# Altium schematic sheet MCU.SchDoc
size A4
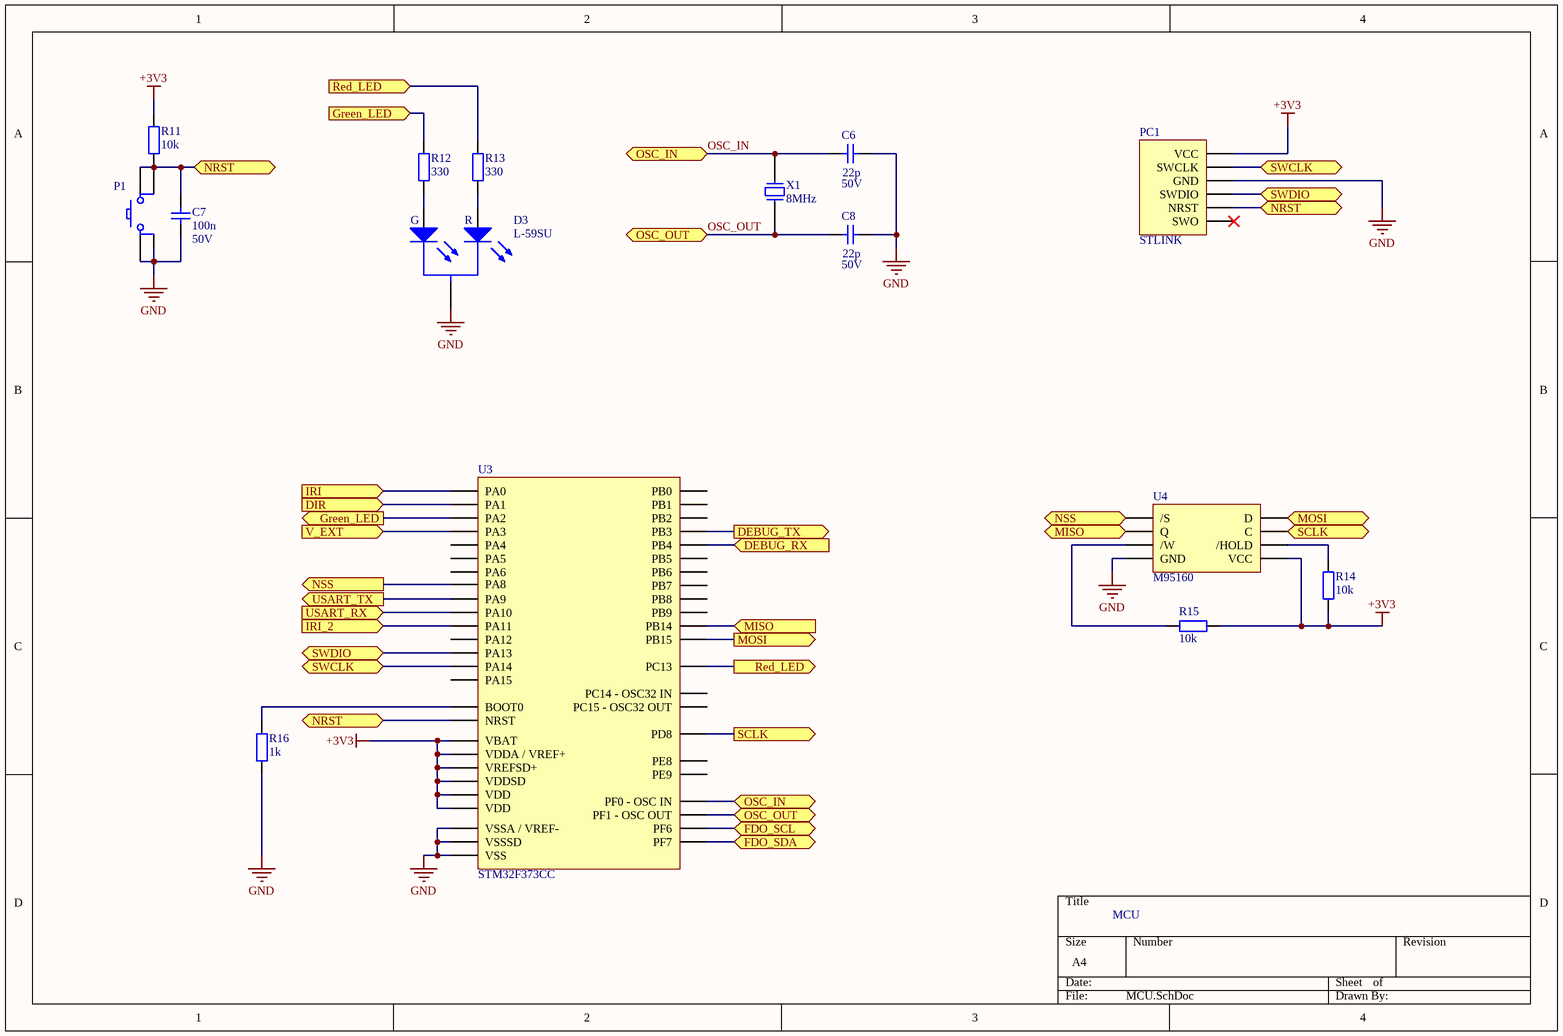
[diagram p0: MCU.SchDoc]

## Parts
C6  value 22p  Voltage Rating: 50V  [C1206]  (hidden comment: CAP)
C7  value 100n  Voltage Rating: 50V  [C1206]  (hidden comment: CAP)
C8  value 22p  Voltage Rating: 50V  [C1206]  (hidden comment: CAP)
D3  L-59SU  [5mmLEDBiCol]
P1  BTN  [PBUTTON]  (value not drawn)
PC1  STLINK  [SWD]
R11  value 10k  [R1206]  (hidden comment: 1206)
R12  value 330  [R1206]  (hidden comment: 1206)
R13  value 330  [R1206]  (hidden comment: 1206)
R14  value 10k  [R1206]  (hidden comment: 1206)
R15  value 10k  [R1206]  (hidden comment: 1206)
R16  value 1k  [R1206]  (hidden comment: 1206)
U3  STM32F373CC  [LQFP48]
U4  M95160  [SOIC8]
X1  value 8MHz  [HC49]  (hidden comment: XTAL)

## Ports
DEBUG_RX (in), DEBUG_TX (out), DIR (in), FDO_SCL (bidir), FDO_SDA (bidir), Green_LED (in), Green_LED (out), IRI (in), IRI_2 (in), MISO (in), MISO (out), MOSI (in), MOSI (out), NRST (bidir), NSS (in), NSS (out), OSC_IN, OSC_OUT, Red_LED (in), Red_LED (out), SCLK (in), SCLK (out), SWCLK (bidir), SWDIO (bidir), USART_RX (in), USART_TX (out), V_EXT (in)

## Nets
+3V3: PC1.1(VCC) R11.1 R14.1 R15.2 U3.1(VBAT) U3.9(VDDA_/_VREF+) U3.17(VDD) U3.24(VDDSD) U3.25(VREFSD+) U3.48(VDD) U4.8(VCC)
GND: C6.1 C7.2 C8.1 D3.2 P1.4 PC1.3(GND) R16.2 U3.8(VSSA_/_VREF-) U3.23(VSSSD) U3.47(VSS) U4.4(GND)
DEBUG_RX: U3.40(PB4) ; port DEBUG_RX
DEBUG_TX: U3.39(PB3) ; port DEBUG_TX
DIR: U3.11(PA1) ; port DIR
FDO_SCL: U3.35(PF6) ; port FDO_SCL
FDO_SDA: U3.36(PF7) ; port FDO_SDA
Green_LED: R12.1 U3.12(PA2) ; port Green_LED
IRI: U3.10(PA0) ; port IRI
IRI_2: U3.32(PA11) ; port IRI_2
MISO: U3.26(PB14) U4.2(Q) ; port MISO
MOSI: U3.27(PB15) U4.5(D) ; port MOSI
NRST: C7.1 P1.1 P1.2 PC1.5(NRST) R11.2 U3.7(NRST) ; port NRST
NSS: U3.29(PA8) U4.1(/S) ; port NSS
OSC_IN: C6.2 U3.5(PF0_-_OSC_IN) X1.1 ; port OSC_IN
OSC_OUT: C8.2 U3.6(PF1_-_OSC_OUT) X1.2 ; port OSC_OUT
Red_LED: R13.1 U3.2(PC13) ; port Red_LED
SCLK: U3.28(PD8) U4.6(C) ; port SCLK
SWCLK: PC1.2(SWCLK) U3.37(PA14) ; port SWCLK
SWDIO: PC1.4(SWDIO) U3.34(PA13) ; port SWDIO
USART_RX: U3.31(PA10) ; port USART_RX
USART_TX: U3.30(PA9) ; port USART_TX
V_EXT: U3.13(PA3) ; port V_EXT
NetD3_1: D3.1 R13.2
NetD3_3: D3.3 R12.2
NetR14_2: R14.2 U4.7(/HOLD)
NetR15_1: R15.1 U4.3(/W)
NetR16_1: R16.1 U3.44(BOOT0)

Not connected (* = marked no-connect by the designer): P1 3; PC1 6(SWO)*; U3 3(PC14_-_OSC32_IN) 4(PC15_-_OSC32_OUT) 14(PA4) 15(PA5) 16(PA6) 18(PB0) 19(PB1) 20(PB2) 21(PE8) 22(PE9) 33(PA12) 38(PA15) 41(PB5) 42(PB6) 43(PB7) 45(PB8) 46(PB9)

## Notes on the sheet
- MCU
- (in symbol L-59SU) G; R

## Library data of the parts
C6-C8 = CAP: Capacitor
D3 = L-59SU: RED/GRE BICOL; Manufacturer: KINGBRIGHT; Manufacturer Part Number: L-59SURKCGKC
P1 = BTN: Push Button
PC1 = STLINK: STLINK programming tool connector
R11-R16 = RES: 1206 Resistor
U4 = M95160: SPI Flash Memory 16kbit
X1 = XTAL: Quartz Crystal